# Altium schematic sheet 011_TempSensors.SchDoc
size A4; Organization: OLTEST; Revision: 01; SheetNumber: 11; SheetTotal: 12; Название листа: Название листа; Разработчик: Бондарчук С.; Прибор: R100; АМАК.000000.000 Э3: R100.220.040.000 Э3; Дата: 24.01.2018; Формат: A4
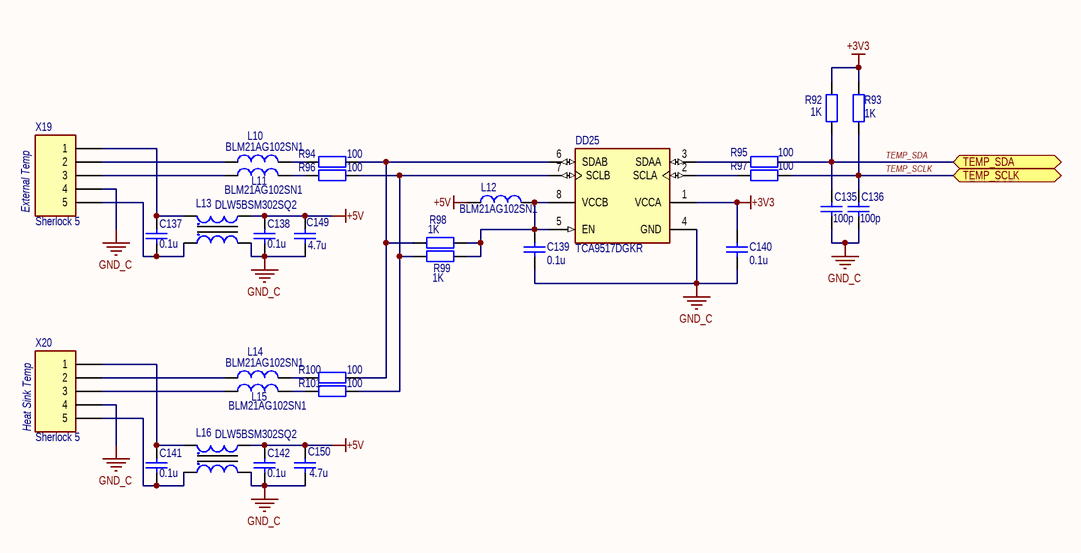
[diagram p0: 011_TempSensors.SchDoc]

## Parts
C135  100p  [SMD_C_0603]
C136  100p  [SMD_C_0603]
C137  0.1u  [SMD_C_0603]
C138  0.1u  [SMD_C_0603]
C139  0.1u  [SMD_C_0603]
C140  0.1u  [SMD_C_0603]
C141  0.1u  [SMD_C_0603]
C142  0.1u  [SMD_C_0603]
C149  4.7u  [SMD_C_0805]
C150  4.7u  [SMD_C_0805]
DD25  TCA9517DGKR  [DGK8_M]
L10  BLM21AG102SN1  [SMD_L_L2_W1.25]
L11  BLM21AG102SN1  [SMD_L_L2_W1.25]
L12  BLM21AG102SN1  [SMD_L_L2_W1.25]
L13  DLW5BSM302SQ2  [DLW5BS(AH)]
L14  BLM21AG102SN1  [SMD_L_L2_W1.25]
L15  BLM21AG102SN1  [SMD_L_L2_W1.25]
L16  DLW5BSM302SQ2  [DLW5BS(AH)]
R92  1K  [SMD_R_0603]
R93  1K  [SMD_R_0603]
R94  100  [SMD_R_0603]
R95  100  [SMD_R_0603]
R96  100  [SMD_R_0603]
R97  100  [SMD_R_0603]
R98  1K  [SMD_R_0603]
R99  1K  [SMD_R_0603]
R100  100  [SMD_R_0603]
R101  100  [SMD_R_0603]
X19  Sherlock 5  [35362-0550]
X20  Sherlock 5  [35362-0550]

## Ports
TEMP_SCLK, TEMP_SDA

## Nets
+3V3: C140.2 DD25.1(VCCA) R92.2 R93.2
+5V: C138.2 C142.2 C149.2 C150.2 L12.1 L13.3 L16.3
GND_C: C135.1 C136.1 C138.1 C139.1 C140.1 C142.1 C149.1 C150.1 DD25.4(GND) L13.2 L16.2 X19.4 X20.4
TEMP_SCLK: C136.2 R93.1 R97.2 ; port TEMP_SCLK
TEMP_SDA: C135.2 R92.1 R95.2 ; port TEMP_SDA
NetC137_1: C137.1 L13.1 X19.5
NetC137_2: C137.2 L13.4 X19.1
NetC139_2: C139.2 DD25.5(EN) DD25.8(VCCB) L12.2 R98.1 R99.1
NetC141_1: C141.1 L16.1 X20.5
NetC141_2: C141.2 L16.4 X20.1
NetDD25_2: DD25.2(SCLA) R97.1
NetDD25_3: DD25.3(SDAA) R95.1
NetDD25_6: DD25.6(SDAB) R94.2 R98.2 R100.2
NetDD25_7: DD25.7(SCLB) R96.2 R99.2 R101.2
NetL10_1: L10.1 X19.2
NetL10_2: L10.2 R94.1
NetL11_1: L11.1 X19.3
NetL11_2: L11.2 R96.1
NetL14_1: L14.1 X20.2
NetL14_2: L14.2 R100.1
NetL15_1: L15.1 X20.3
NetL15_2: L15.2 R101.1

## Notes on the sheet
- (near X19) External Temp
- (near X20) Heat Sink Temp
- Разработчик:
- Формат:
- Rev.:
- Лист
- Дата:
- Листов
- WorkSpace:
- Дата изм.:

## Library data of the parts
C135 C136 = C0603 100p 100V 5%: SMD C 0603 MURATA 100V 5% NP0; PartNumber: GRM1885C2A101JA01; Manufacturer: MURATA; Value: 100p
C137-C142 = C0603 0.1u 50V 10%: SMD C 0603 MURATA 50V 10% X7R; PartNumber: GRM188R71H104K; Manufacturer: MURATA; Value: 0.1u
C149 C150 = C0805 4.7u 25V 20%  X5R: SMD C 0805 MURATA 50V 5% NP0; PartNumber: GRM21BR61E475M; Manufacturer: MURATA; Value: 4.7u
DD25 = TCA9517DGKR: Level-Shifting I 2C Bus Repeater; Manufacturer: Texas Instruments; PartNumber: TCA9517DGKR
L10-L12 L14 L15 = BLM21AG102SN1: 1000R 0.6A (100MHz); Manufacturer: TDK; Value: 1000R 0.6A (100MHz); PartNumber: BLM21AG102SN1
L13 L16 = DLW5BSM302SQ2: SMD Common Mode Choke Coil 0.5A Z = 3000 Ohm / 100 MHz; Manufacturer: MURATA; PartNumber: DLW5BSM302SQ2
R92 R93 R98 R99 = R0603 1K 1%: SMD R 0603 VISHAY 0.1W 75V 1% 100ppm; PartNumber: CRCW06031K00FK; Manufacturer: VISHAY; Value: 1K
R94-R97 R100 R101 = R0603 100 1%: SMD R 0603 VISHAY 0.1W 75V 1% 100ppm; PartNumber: CRCW0603100RFK; Manufacturer: VISHAY; Value: 100
X19 X20 = 35362-0550: Sherlock 5 Top, 2A 125V 2mm; Manufacturer: MOLEX; PartNumber: 35362-0550